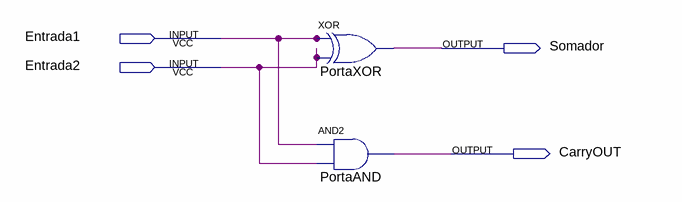
[diagram p0: schematic sheet]
// Quartus schematic Meio_Somador.bdf as structural Verilog: 2 symbols, 4 pins
module Meio_Somador (
  input  Entrada1,
  input  Entrada2,
  output Somador,
  output CarryOUT
);

  xor PortaXOR (Somador, Entrada1, Entrada2);
  and PortaAND (CarryOUT, Entrada1, Entrada2);
endmodule
